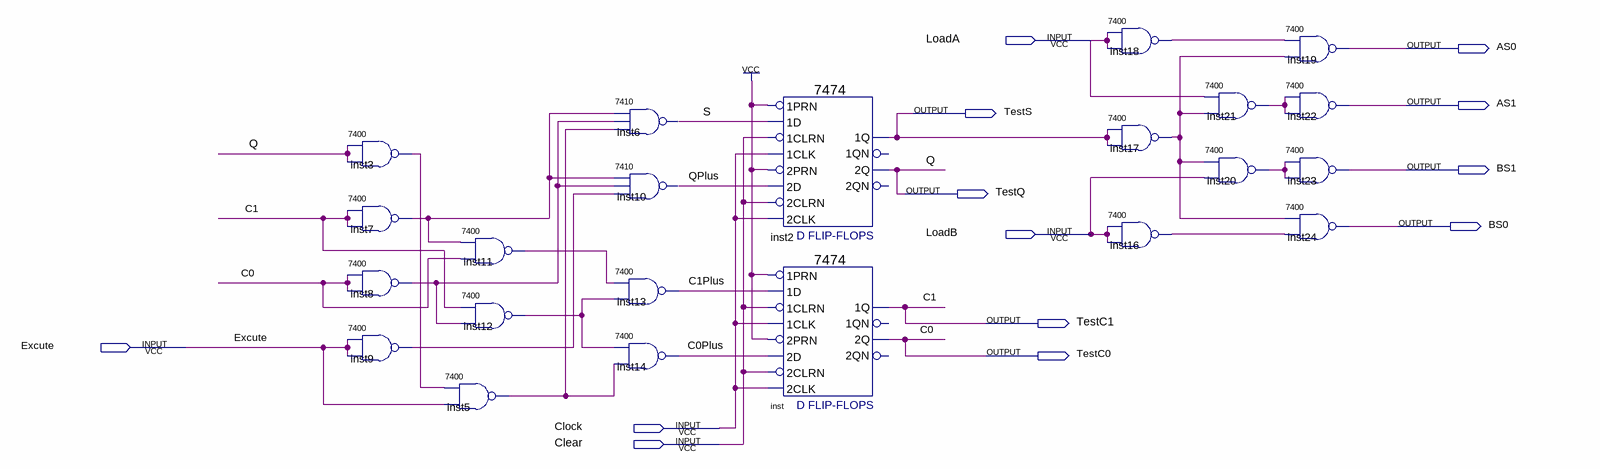
[diagram p0: schematic sheet]
// Quartus schematic ControlUnit.bdf as structural Verilog: 22 symbols, 13 pins
module ControlUnit (
  input  LoadA,
  input  LoadB,
  input  Excute,
  input  Clock,
  input  Clear,
  output AS0,
  output AS1,
  output TestS,
  output BS1,
  output TestQ,
  output BS0,
  output TestC1,
  output TestC0
);

  wire C0Plus, C1Plus, inst3_1, inst5_1, inst7_1, inst8_1, inst9_1, inst11_1, inst12_1, inst16_1, inst17_1,
       inst18_1, inst20_1, inst21_1, QPlus, S;

  \7400  inst3 (.\3 (TestQ), .\2 (TestQ), .\1 (inst3_1));
  \7400  inst7 (.\3 (TestC1), .\2 (TestC1), .\1 (inst7_1));
  \7400  inst8 (.\3 (TestC0), .\2 (TestC0), .\1 (inst8_1));
  \7400  inst9 (.\3 (Excute), .\2 (Excute), .\1 (inst9_1));
  \7400  inst11 (.\3 (TestC0), .\2 (inst7_1), .\1 (inst11_1));
  \7400  inst12 (.\3 (inst8_1), .\2 (TestC1), .\1 (inst12_1));
  \7400  inst5 (.\3 (Excute), .\2 (inst3_1), .\1 (inst5_1));
  \7410  inst6 (.\2 (inst7_1), .\3 (inst8_1), .\4 (inst5_1), .\1 (S));
  \7410  inst10 (.\2 (inst7_1), .\3 (inst8_1), .\4 (inst9_1), .\1 (QPlus));
  \7400  inst13 (.\3 (inst12_1), .\2 (inst11_1), .\1 (C1Plus));
  \7400  inst14 (.\3 (inst5_1), .\2 (inst12_1), .\1 (C0Plus));
  \7474  inst2 (
    .\2D (QPlus), .\2PRN (1'b1), .\1CLK (Clock), .\1D (S), .\1PRN (1'b1), .\2CLK (Clock), .\2CLRN (Clear),
    .\1CLRN (Clear), .\2Q (TestQ), .\1Q (TestS));  // open: 1QN, 2QN
  \7474  inst (
    .\2D (C0Plus), .\2PRN (1'b1), .\1CLK (Clock), .\1D (C1Plus), .\1PRN (1'b1), .\2CLK (Clock),
    .\2CLRN (Clear), .\1CLRN (Clear), .\2Q (TestC0), .\1Q (TestC1));  // open: 1QN, 2QN
  \7400  inst18 (.\3 (LoadA), .\2 (LoadA), .\1 (inst18_1));
  \7400  inst17 (.\3 (TestS), .\2 (TestS), .\1 (inst17_1));
  \7400  inst16 (.\3 (LoadB), .\2 (LoadB), .\1 (inst16_1));
  \7400  inst21 (.\3 (inst17_1), .\2 (LoadA), .\1 (inst21_1));
  \7400  inst20 (.\3 (LoadB), .\2 (inst17_1), .\1 (inst20_1));
  \7400  inst19 (.\3 (inst17_1), .\2 (inst18_1), .\1 (AS0));
  \7400  inst22 (.\3 (inst21_1), .\2 (inst21_1), .\1 (AS1));
  \7400  inst23 (.\3 (inst20_1), .\2 (inst20_1), .\1 (BS1));
  \7400  inst24 (.\3 (inst16_1), .\2 (inst17_1), .\1 (BS0));

  // Other names for the same wires on the sheet: C0 = TestC0; C1 = TestC1; Q = TestQ
endmodule
